# Altium schematic sheet 02.RNF24L01_PWM_BTN.SchDoc
size A4
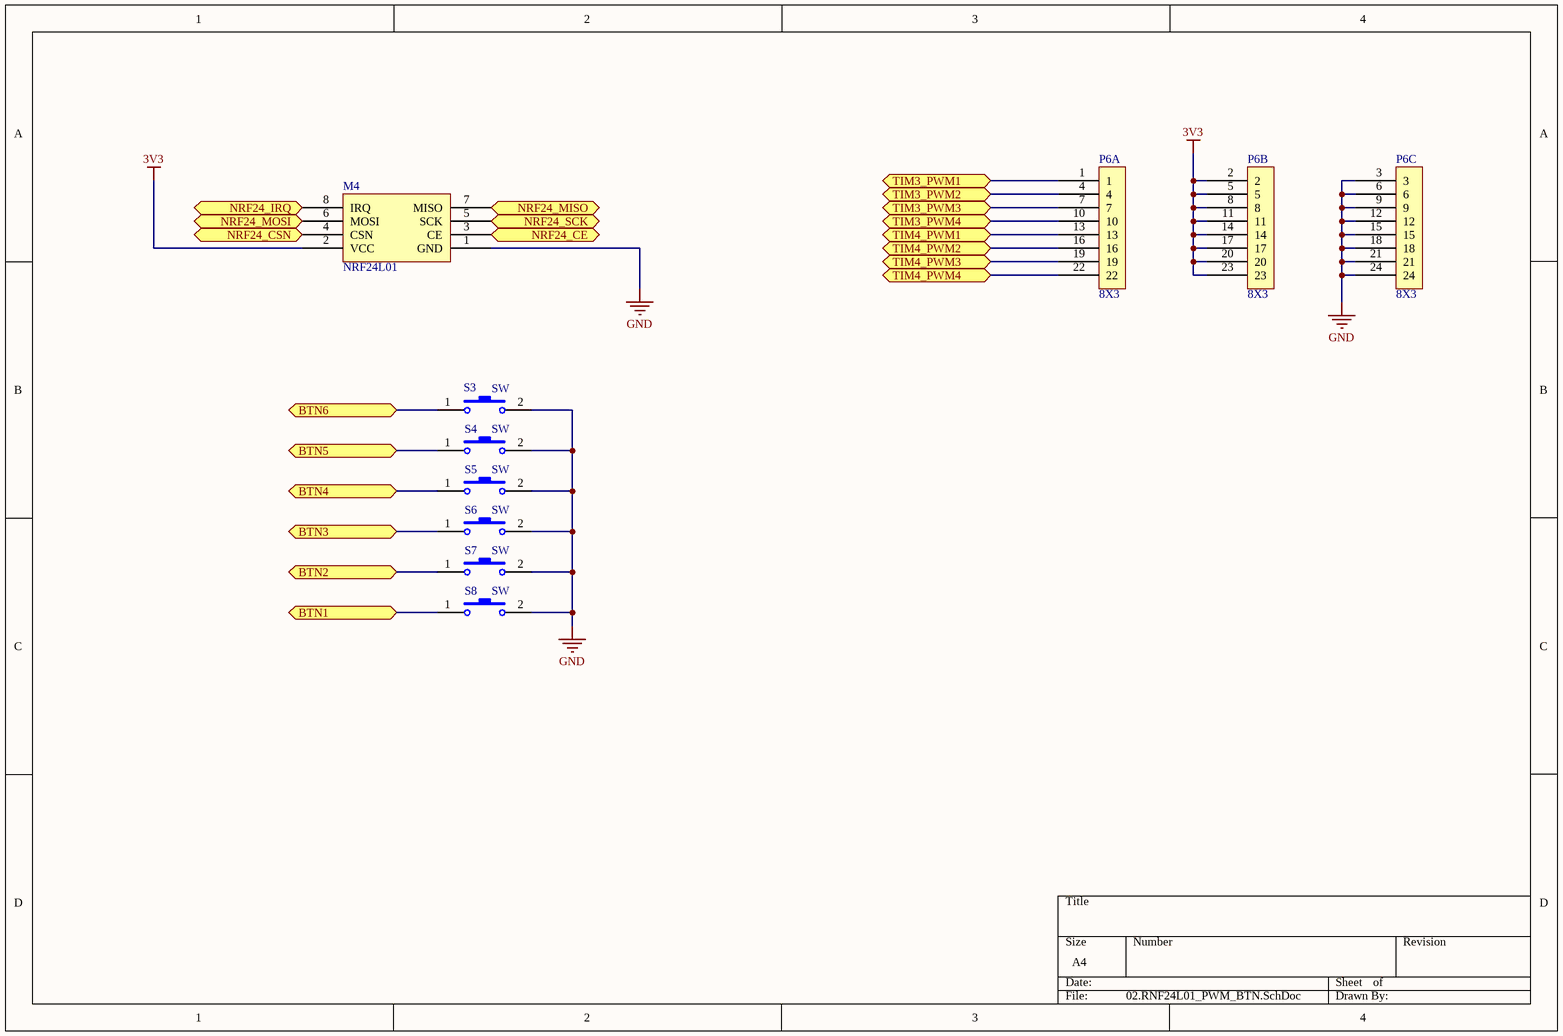
[diagram p0: 02.RNF24L01_PWM_BTN.SchDoc]

## Parts
M4  NRF24L01  [HDR2X4]
P6  8X3  [HDR3X8-2.54]  (parts A,B,C of 3)
S3  SW  [SW4-6X6]
S4  SW  [SW4-6X6]
S5  SW  [SW4-6X6]
S6  SW  [SW4-6X6]
S7  SW  [SW4-6X6]
S8  SW  [SW4-6X6]

## Ports
BTN1, BTN2, BTN3, BTN4, BTN5, BTN6, NRF24_CE, NRF24_CSN, NRF24_IRQ, NRF24_MISO, NRF24_MOSI, NRF24_SCK, TIM3_PWM1, TIM3_PWM2, TIM3_PWM3, TIM3_PWM4, TIM4_PWM1, TIM4_PWM2, TIM4_PWM3, TIM4_PWM4

## Nets
3V3: M4.2(VCC) P6.2 P6.5 P6.8 P6.11 P6.14 P6.17 P6.20 P6.23
GND: M4.1(GND) P6.3 P6.6 P6.9 P6.12 P6.15 P6.18 P6.21 P6.24 S3.2 S4.2 S5.2 S6.2 S7.2 S8.2
BTN1: S8.1 ; port BTN1
BTN2: S7.1 ; port BTN2
BTN3: S6.1 ; port BTN3
BTN4: S5.1 ; port BTN4
BTN5: S4.1 ; port BTN5
BTN6: S3.1 ; port BTN6
NRF24_CE: M4.3(CE) ; port NRF24_CE
NRF24_CSN: M4.4(CSN) ; port NRF24_CSN
NRF24_IRQ: M4.8(IRQ) ; port NRF24_IRQ
NRF24_MISO: M4.7(MISO) ; port NRF24_MISO
NRF24_MOSI: M4.6(MOSI) ; port NRF24_MOSI
NRF24_SCK: M4.5(SCK) ; port NRF24_SCK
TIM3_PWM1: P6.1 ; port TIM3_PWM1
TIM3_PWM2: P6.4 ; port TIM3_PWM2
TIM3_PWM3: P6.7 ; port TIM3_PWM3
TIM3_PWM4: P6.10 ; port TIM3_PWM4
TIM4_PWM1: P6.13 ; port TIM4_PWM1
TIM4_PWM2: P6.16 ; port TIM4_PWM2
TIM4_PWM3: P6.19 ; port TIM4_PWM3
TIM4_PWM4: P6.22 ; port TIM4_PWM4

## Library data of the parts
S3-S8 = SW: Switch; Published: 24-Mar-1999; LatestRevisionDate: 17-Jul-2002; LatestRevisionNote: Re-released for DXP Platform.; PackageReference: SPST-2; Publisher: Altium Limited